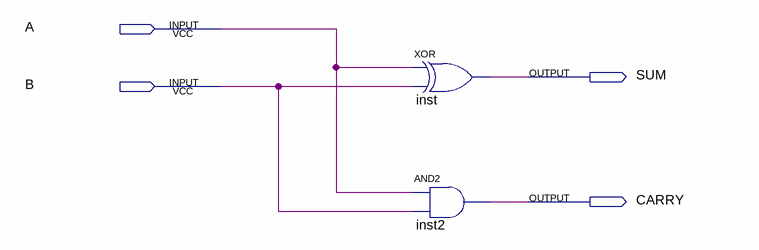
[diagram p0: schematic sheet]
// Quartus schematic Half_Adder.bdf as structural Verilog: 2 symbols, 4 pins
module Half_Adder (
  input  A,
  input  B,
  output SUM,
  output CARRY
);

  xor inst (SUM, A, B);
  and inst2 (CARRY, A, B);
endmodule
